# Altium project Motion Detector PCB.PrjPcb (part 1 of 4)
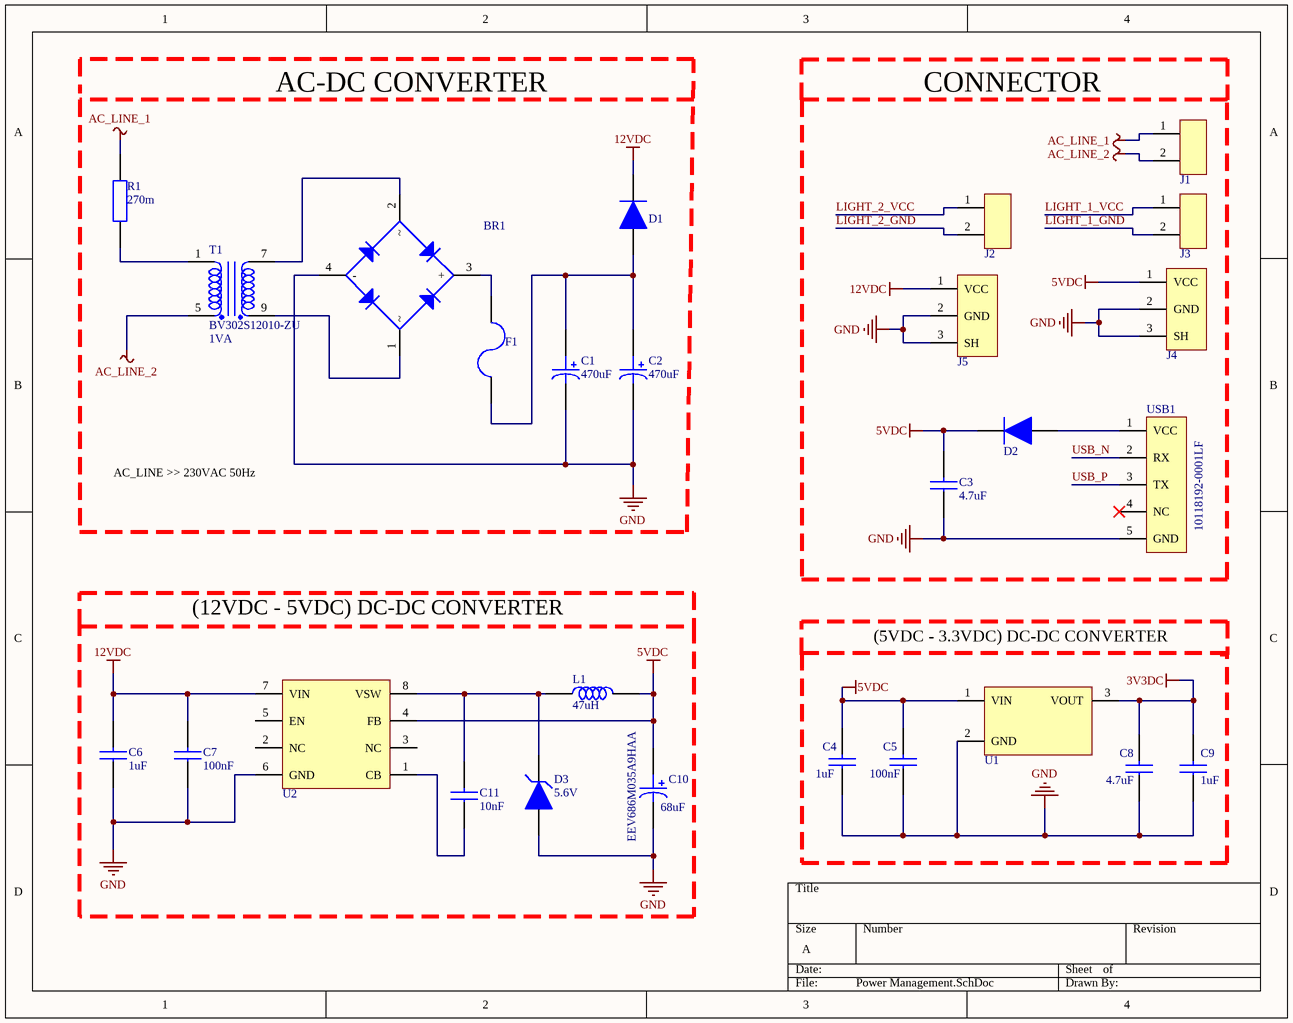
[diagram p0: Power Management.SchDoc]
5 sheets, 127 parts. Net scope: global (net labels, ports and power ports of the same name join across sheets).
Board file: Motion Detector PCB.PcbDoc
Sheets:
  Power Management.SchDoc
  MicroControllers.SchDoc
  Sensor Modules.SchDoc
  WIFI Module.SchDoc
  Sensor Board.SchDoc

## Sheet Power Management.SchDoc
size A; SheetNumber: 3; SheetTotal: 7

### Parts
BR1  DB105STR  [DB105STR]  (value not drawn)
C1  Capacitance: 470uF  [CAP_RADIAL_D10_P5]  (hidden comment: ESH477M050AH4AA)
C2  Capacitance: 470uF  [CAP_RADIAL_D10_P5]  (hidden comment: ESH477M050AH4AA)
C3  Capacitance: 4.7uF  [CAP_0805]  (hidden comment: CL21A475KAQNNNE)
C4  Capacitance: 1uF  [CAP_0805]  (hidden comment: CL21B105KBFNNNE)
C5  Capacitance: 100nF  [CAP_0805]  (hidden comment: CL21B104KBCNNNC)
C6  Capacitance: 1uF  [CAP_0805]  (hidden comment: CL21B105KBFNNNE)
C7  Capacitance: 100nF  [CAP_0805]  (hidden comment: CL21B104KBCNNNC)
C8  Capacitance: 4.7uF  [CAP_0805]  (hidden comment: CL21A475KAQNNNE)
C9  Capacitance: 1uF  [CAP_0805]  (hidden comment: CL21B105KBFNNNE)
C10  EEV686M035A9HAA  Capacitance: 68uF  [CAP_EEVseries]
C11  Capacitance: 10nF  [CAP_0603]  (hidden comment: 0603B103K160CT)
D1  1N4148WS  [SOD323F]  (value not drawn)
D2  1N4148WS  [SOD323F]  (value not drawn)
D3  Working Voltage: 5.6V  [SMB]  (hidden comment: 1SMB5919BT3G)
F1  3413.0216.22  [3413.0216.22]  (value not drawn)
J1  TBP01R1-508-02BE  [TBP01R1-508]  (value not drawn)
J2  TBP01R1-508-02BE  [TBP01R1-508]  (value not drawn)
J3  TBP01R1-508-02BE  [TBP01R1-508]  (value not drawn)
J4  PJ-037AH-SMT-TR  [JACK]  (value not drawn)
J5  PJ-037AH-SMT-TR  [JACK]  (value not drawn)
L1  Inductance: 47uH  [IND_1212]  (hidden comment: 78438335470)
R1  Resistance: 270m  [RES_AXIAL_W]  (hidden comment: 5WD27)
T1  BV302S12010-ZU  Rated Power: 1VA  [BV302S]
U1  AP7361-33E-13  [SOT223]  (value not drawn)
U2  LM2675MX-12/NOPB  [SOIC8]  (value not drawn)
USB1  10118192-0001LF  [MICRO_B_USB]

### Blocks framed on the sheet
CONNECTOR: C3 D2 J1-J5 USB1
(12VDC - 5VDC) DC-DC CONVERTER: C6 C7 C10 C11 D3 L1 U2
(5VDC - 3.3VDC) DC-DC CONVERTER: C4 C5 C8 C9 U1

### Nets
3V3DC: C8.2 C9.2 U1.3(VOUT)
5VDC: C3.2 C4.2 C5.2 C10.1 D2.1 J4.1(VCC) L1.2 U1.1(VIN) U2.4(FB)
12VDC: C6.2 C7.2 D1.1 J5.1(VCC) U2.7(VIN)
AC_LINE_1: J1.1 R1.1
AC_LINE_2: J1.2 T1.5
GND: BR1.4(-) C1.2 C2.2 C3.1 C4.1 C5.1 C6.1 C7.1 C8.1 C9.1 C10.2 D3.A J4.2(GND) J4.3(SH) J5.2(GND) J5.3(SH) U1.2(GND) U2.6(GND) USB1.5(GND)
LIGHT_1_GND: J3.2
LIGHT_1_VCC: J3.1
LIGHT_2_GND: J2.2
LIGHT_2_VCC: J2.1
USB_N: USB1.2(RX)
USB_P: USB1.3(TX)
NetBR1_1: BR1.1 T1.9
NetBR1_2: BR1.2 T1.7
NetBR1_3: BR1.3(+) F1.1
NetC1_1: C1.1 C2.1 D1.2 F1.2
NetC11_1: C11.1 U2.1(CB)
NetC11_2: C11.2 D3.C L1.1 U2.8(VSW)
NetD2_2: D2.2 USB1.1(VCC)
NetR1_2: R1.2 T1.1

Not connected (* = marked no-connect by the designer): U2 2(NC) 3(NC) 5(EN); USB1 4(NC)*

### Notes on the sheet
- AC-DC CONVERTER
- AC_LINE >> 230VAC 50Hz

### Library data of the parts
BR1 = DB105STR: Bridge Diode AC-DC; Manufacturer: Sangdest Microelectronics; Designed by: BERK; Max Current: 1A; Operating Voltage: 600V; Supplier 1: Digi-Key; Manufacturer Part Number: DB105STR; RoHS: No; Supplier Part Number 1: 1655-1821-1-ND
C1 C2 = CAP ALU ELEC 470uF 50V: CAP ALU ELEC 470uF 50V RADIAL; Manufacturer: KEMET; Designed by: BERK; Polarity: Polar; Tolerance: 20%; Life (Hours): 2000Hour; Supplier 1: Digi-Key; Manufacturer Part Number: ESH477M050AH4AA; RoHS: No; Stock 1: 1181; Pricing 1: 1=0,59000, 10=0,41700, 50=0,31540, 100=0,27470, 500=0,20350, 1000=0,17298, 2500=0,16280, 5000=0,15262 (USD); Mount: Through Hole; Case/Package: Radial; Min Operating Temperature: -40°C; Max Operating Temperature: 105°C; Packaging: Bulk; Voltage Rating: 50V; RoHS Compliant: No; ComponentLink1URL: https://api.kemet.com/component-edge/download/datasheet/ESH477M050AH4AA.pdf?src-supplier=Digi-Key; ComponentLink1Description: https://api.kemet.com/component-edge/download/datasheet/ESH477M050AH4AA.pdf?src-supplier=Digi-Key; Supplier Part Number 1: 399-15683-ND
C3 C8 = CAP CER 4.7uF 0805: CAP CER 4.7uF %10 0805; Manufacturer: Samsung; Tolerance: 10%; Voltage Rating: 25V; Dielectric: X5R; Designed by: BERK; Supplier 1: Digi-Key; Manufacturer Part Number: CL21A475KAQNNNE; RoHS: Yes; Category: Ceramic Capacitors; Stock 1: 1477018; Pricing 1: 1=0,11000, 10=0,08100, 50=0,04580, 100=0,03800, 500=0,02664, 1000=0,02205 (USD); Mount: Surface Mount; Case/Package: 0805; Case Code (Metric): 2012; Case Code (Imperial): 0805; Min Operating Temperature: -55°C; Max Operating Temperature: 85°C; Package Quantity: 1; Packaging: Tape and Reel; Voltage Rating (DC): 25V; Series: CL; Construction: Flat; Length: 2mm; Width: 0.049inch; Height: 1.25mm; Thickness: 0.055inch; Depth: 1.25mm; Radiation Hardening: No; Lead Free: Lead Free; RoHS Compliant: Yes; ComponentLink1URL: https://datasheet.ciiva.com/25798/cl21a475kaqnnne-25798882.pdf?src-supplier=Digi-Key; ComponentLink1Description: https://datasheet.ciiva.com/25798/cl21a475kaqnnne-25798882.pdf?src-supplier=Digi-Key; Supplier Part Number 1: 1276-1244-1-ND
C4 C6 C9 = CAP CER 1uF 0805: CAP CER 1uF %10 0805; Manufacturer: Samsung; Designed by: BERK; Tolerance: 10%; Voltage Rating: 50V; Dielectric: X7R; Supplier 1: Digi-Key; Manufacturer Part Number: CL21B105KBFNNNE; RoHS: Yes; Category: Ceramic Capacitors; Stock 1: 958000; Pricing 1: 2000=0,02138, 4000=0,01956 (USD); Mount: Surface Mount; Case/Package: 0805; Case Code (Metric): 2012; Case Code (Imperial): 0805; Min Operating Temperature: -55°C; Max Operating Temperature: 125°C; Packaging: Tape and Reel; Package Quantity: 1; Voltage: 50V; Series: CL; Construction: Flat; Length: 2mm; Width: 0.049inch; Height: 1.25mm; Thickness: 0.053inch; Depth: 1.25mm; Radiation Hardening: No; RoHS Compliant: Yes; ComponentLink1URL: https://datasheet.ciiva.com/25800/cl21b105kbfnnne-25800291.pdf?src-supplier=Digi-Key; ComponentLink1Description: https://datasheet.ciiva.com/25800/cl21b105kbfnnne-25800291.pdf?src-supplier=Digi-Key; ComponentLink2URL: https://datasheet.ciiva.com/16449/cl21b105kbfnnne-16449003.pdf?src-supplier=Future+Electronics; ComponentLink2Description: https://datasheet.ciiva.com/16449/cl21b105kbfnnne-16449003.pdf?src-supplier=Future+Electronics; ComponentLink3URL: https://datasheet.ciiva.com/26838/getdatasheetpartid-354075-26838668.pdf?src-supplier=Verical; ComponentLink3Description: https://datasheet.ciiva.com/26838/getdatasheetpartid-354075-26838668.pdf?src-supplier=Verical; Supplier Part Number 1: 1276-1029-2-ND
C5 C7 = CAP CER 100nF 0805: CAP CER 100nF %10 0805; Manufacturer: Samsung; Designed by: BERK; Material: Ceramic; Tolerance: 10%; Dielectric: X7R; Voltage Rating: 50V; Supplier 1: Digi-Key; Manufacturer Part Number: CL21B104KBCNNNC; RoHS: Yes; Category: Ceramic Capacitors; Stock 1: 3371502; Pricing 1: 1=0,10000, 10=0,04700, 50=0,02560, 100=0,02090, 500=0,01494, 1000=0,01174 (USD); Mount: Surface Mount; Case/Package: 0805; Case Code (Metric): 2012; Case Code (Imperial): 0805; Contact Plating: Tin; Min Operating Temperature: -55°C; Max Operating Temperature: 125°C; Packaging: Tape and Reel; Voltage: 50V; Voltage Rating (DC): 50V; Series: CL; Construction: Flat; Length: 2mm; Width: 0.049inch; Height: 0.85mm; Depth: 1.25mm; Thickness: 0.037inch; Radiation Hardening: No; Lead Free: Lead Free; RoHS Compliant: Yes; ComponentLink1URL: https://datasheet.ciiva.com/25710/cl21b104kbcnnnc-25710182.pdf?src-supplier=Digi-Key; ComponentLink1Description: https://datasheet.ciiva.com/25710/cl21b104kbcnnnc-25710182.pdf?src-supplier=Digi-Key; ComponentLink2URL: https://datasheet.ciiva.com/29199/454152-da-01-en-vs-kondensator-0805-29199814.pdf?src-supplier=Conrad; ComponentLink2Description: https://datasheet.ciiva.com/29199/454152-da-01-en-vs-kondensator-0805-29199814.pdf?src-supplier=Conrad; Supplier Part Number 1: 1276-1003-1-ND
C10 = CAP ALU 68uF: Cap Aluminum Lytic 68uF 35V 20% (6.3 X 7.7mm) SMD 280mA 2000h 105C T/R; Manufacturer: KEMET; Impedance: 340mR; Ripple Current: 196mA; Life (Hours): 2000Hour; Designator by: BERK; Supplier 1: Digi-Key; Manufacturer Part Number: EEV686M035A9HAA; RoHS: Yes; Category: Aluminum Electrolytic Capacitors; Stock 1: 543; Pricing 1: 1=0,54000, 10=0,38000, 50=0,28740, 100=0,25040, 500=0,18546 (USD); Mount: Surface Mount; Case/Package: Radial; Min Operating Temperature: -40°C; Max Operating Temperature: 105°C; Packaging: Tape and Reel; Package Quantity: 1; Voltage Rating: 35V; Tolerance: 20%; Voltage Rating (DC): 35V; Termination: SMD/SMT; Series: EEV; Length: 7.7mm; Height - Seated (Max): 0.315inch; RoHS Compliant: Yes; ComponentLink1URL: https://datasheet.ciiva.com/5365/kem-a4002-eev-535332-5365784.pdf?src-supplier=Mouser; ComponentLink1Description: https://datasheet.ciiva.com/5365/kem-a4002-eev-535332-5365784.pdf?src-supplier=Mouser; Supplier Part Number 1: 399-6722-1-ND
C11 = CAP CER 10nF 0603: CAP CER 10nF %10 0603; Manufacturer: Walsin Technologies; Designed by: BERK; Tolerance: 10%; Dielectric: X7R; Voltage Rating: 16V; Supplier 1: Digi-Key; Manufacturer Part Number: 0603B103K160CT; RoHS: Yes; Category: Ceramic Capacitors; Stock 1: 102474; Pricing 1: 1=0,10000, 10=0,03600, 50=0,01940, 100=0,01590, 500=0,01136, 1000=0,00892 (USD); Case/Package: 0603; Case Code (Metric): 1608; Case Code (Imperial): 0603; Min Operating Temperature: -55°C; Max Operating Temperature: 125°C; Packaging: Tape and Reel; Voltage Rating (DC): 16V; Length: 1.6mm; Depth: 0.8mm; REACH SVHC: Unknown; RoHS Compliant: Yes; ComponentLink1URL: http://www.farnell.com/datasheets/1958513.pdf?src-supplier=Farnell; ComponentLink1Description: http://www.farnell.com/datasheets/1958513.pdf?src-supplier=Farnell; ComponentLink2URL: http://components.arrow.com/part/dataview/0323_00656382?src-supplier=Arrow+Europe; ComponentLink2Description: http://components.arrow.com/part/dataview/0323_00656382?src-supplier=Arrow+Europe; ComponentLink3URL: http://www.farnell.com/datasheets/1958513.pdf?src-supplier=Element14; ComponentLink3Description: http://www.farnell.com/datasheets/1958513.pdf?src-supplier=Element14; ComponentLink4URL: http://www.passivecomponent.com/wp-content/uploads/2018/10/MLCC.pdf?src-supplier=Digi-Key; ComponentLink4Description: http://www.passivecomponent.com/wp-content/uploads/2018/10/MLCC.pdf?src-supplier=Digi-Key; Supplier Part Number 1: 1292-1384-1-ND
D1 D2 = 1N4148WS: Diode, Single, 75 V, 150 mA, 1 V, 4 ns; Manufacturer: ON Semiconductor / Fairchild; Designed by: BERK; Forward Current: 150mA; Reverse Recovery Time: 4ns; Max Repetitive Reverse Voltage (Vrrm): 75V; Power Dissipation: 200mW; Max Reverse Current: 5uA; Forward Voltage: 1V; Max Forward Surge Current (Ifsm): 2A; Supplier 1: Digi-Key; Manufacturer Part Number: 1N4148WS; RoHS: Yes; Category: Rectifier Diodes; Stock 1: 79118; Pricing 1: 1=0,17000, 10=0,12100, 100=0,06530, 500=0,05128, 1000=0,03562 (USD); Mount: Surface Mount; Number of Pins: 2; Contact Plating: Tin,Matte; Weight: 0.0276g; Min Operating Temperature: -55°C; Max Operating Temperature: 150°C; Packaging: Tape and Reel; Package Quantity: 1; Recovery Time: 4ns; Average Rectified Current: 150mA; Element Configuration: Single; Reverse Voltage: 75V; Max Reverse Voltage (DC): 75V; Series: -; Length: 1.8mm; Width: 1.35mm; Height: 1mm; Radiation Hardening: No; REACH SVHC: No SVHC; Lead Free: Lead Free; RoHS Compliant: Yes; ComponentLink1URL: https://datasheet.ciiva.com/25968/1n914bws-25968945.pdf?src-supplier=Avnet+Europe; ComponentLink1Description: https://datasheet.ciiva.com/25968/1n914bws-25968945.pdf?src-supplier=Avnet+Europe; ComponentLink2URL: https://datasheet.ciiva.com/30479/0900766b810e1cd3-30479206.pdf?src-supplier=RSComponents; ComponentLink2Description: https://datasheet.ciiva.com/30479/0900766b810e1cd3-30479206.pdf?src-supplier=RSComponents; ComponentLink3URL: https://datasheet.ciiva.com/910/1n4148ws-910381.pdf?src-supplier=Digi-Key; ComponentLink3Description: https://datasheet.ciiva.com/910/1n4148ws-910381.pdf?src-supplier=Digi-Key; ComponentLink4URL: https://datasheet.ciiva.com/15208/getdatasheetpartid-127819-15208358.pdf?src-supplier=Verical; ComponentLink4Description: https://datasheet.ciiva.com/15208/getdatasheetpartid-127819-15208358.pdf?src-supplier=Verical; ComponentLink5URL: https://datasheet.ciiva.com/8300/1n914bws-8300360.pdf?src-supplier=Avnet; ComponentLink5Description: https://datasheet.ciiva.com/8300/1n914bws-8300360.pdf?src-supplier=Avnet; ComponentLink6URL: https://datasheet.ciiva.com/910/1n4148ws-910380.pdf?src-supplier=Digi-Key; ComponentLink6Description: https://datasheet.ciiva.com/910/1n4148ws-910380.pdf?src-supplier=Digi-Key; ComponentLink7URL: https://datasheet.ciiva.com/910/1n4148ws-910382.pdf?src-supplier=Digi-Key; ComponentLink7Description: https://datasheet.ciiva.com/910/1n4148ws-910382.pdf?src-supplier=Digi-Key; Supplier Part Number 1: 1N4148WSFSCT-ND
D3 = 1SMB5919BT3G: Diode Zener Single 5.6V 5% 3W 2-Pin SMB T/R; Manufacturer: ON Semiconductor; Designed by: BERK; Material: Plastic; Max Reverse Leakage Current: 5uA; Impedance: 2R; Forward Voltage: 1.5V; Power Dissipation: 550mW; Zener Current: 267mA; Test Current: 66.9mA; Breakdown Voltage: 5.88V; ESD Protection: Yes; Supplier 1: Digi-Key; Manufacturer Part Number: 1SMB5919BT3G; RoHS: Yes; Category: Zener Diodes; Pricing 1: 1=0,45000, 10=0,31900, 100=0,16110, 500=0,14274, 1000=0,11109 (USD); Case/Package: SMB; Number of Pins: 2; Contact Plating: Tin,Matte; Min Operating Temperature: -65°C; Max Operating Temperature: 150°C; Package Quantity: 1; Packaging: Tape and Reel; Max Power Dissipation: 3W; Tolerance: 5%; Voltage Tolerance: 5%; Zener Voltage: 5.6V; Element Configuration: Single; Voltage Rating (DC): 5.6V; Power Rating: 3W; Length: 4.32mm; Width: 3.56mm; Height: 2.13mm; Radiation Hardening: No; Lead Free: Lead Free; Halogen Free: Halogen Free; REACH SVHC: No SVHC; ComponentLink1URL: https://datasheet.ciiva.com/27747/1308331-27747654.pdf?src-supplier=Jameco; ComponentLink1Description: https://datasheet.ciiva.com/27747/1308331-27747654.pdf?src-supplier=Jameco; ComponentLink2URL: https://datasheet.ciiva.com/1182/1smb5913bt3-d-1182657.pdf?src-supplier=Element14; ComponentLink2Description: https://datasheet.ciiva.com/1182/1smb5913bt3-d-1182657.pdf?src-supplier=Element14; ComponentLink3URL: https://datasheet.ciiva.com/1182/1smb5913bt3-d-1182658.pdf?src-supplier=Element14; ComponentLink3Description: https://datasheet.ciiva.com/1182/1smb5913bt3-d-1182658.pdf?src-supplier=Element14; ComponentLink4URL: https://datasheet.ciiva.com/895/1smb5913bt3-d-895203.pdf?src-supplier=Digi-Key; ComponentLink4Description: https://datasheet.ciiva.com/895/1smb5913bt3-d-895203.pdf?src-supplier=Digi-Key; ComponentLink5URL: https://datasheet.ciiva.com/895/1smb5913bt3-d-895204.pdf?src-supplier=Digi-Key; ComponentLink5Description: https://datasheet.ciiva.com/895/1smb5913bt3-d-895204.pdf?src-supplier=Digi-Key; ComponentLink6URL: https://datasheet.ciiva.com/895/1smb5913bt3-d-895205.pdf?src-supplier=Digi-Key; ComponentLink6Description: https://datasheet.ciiva.com/895/1smb5913bt3-d-895205.pdf?src-supplier=Digi-Key; ComponentLink7URL: https://datasheet.ciiva.com/15198/getdatasheetpartid-311040-15198695.pdf?src-supplier=Verical; ComponentLink7Description: https://datasheet.ciiva.com/15198/getdatasheetpartid-311040-15198695.pdf?src-supplier=Verical; ComponentLink8URL: https://datasheet.ciiva.com/16311/1smb5913bt3-d-16311847.pdf?src-supplier=Future+Electronics; ComponentLink8Description: https://datasheet.ciiva.com/16311/1smb5913bt3-d-16311847.pdf?src-supplier=Future+Electronics; ComponentLink9URL: https://datasheet.ciiva.com/16472/1smb5913bt3-d-16472779.pdf?src-supplier=Avnet+Asia; ComponentLink9Description: https://datasheet.ciiva.com/16472/1smb5913bt3-d-16472779.pdf?src-supplier=Avnet+Asia; Max Reverse Current: 5uA; Supplier Part Number 1: 1SMB5919BT3GOSCT-ND
F1 = FUSE 3413.0216.22: FUSE BRD MNT 1A 32VAC 63VDC 1206; Manufacturer: Schurter; Body Material: Glass,Epoxy; Max Voltage Rating (DC): 63V; Voltage Rating (AC): 32V; DC Cold Resistance: 94.2mR; Fuse Type: Board Mount (Cartridge Style Excluded); Approvals: VDE,cURus; Designed by: BERK; Supplier 1: Digi-Key; Manufacturer Part Number: 3413.0216.22; RoHS: Yes; Category: Fuses; Stock 1: 609; Pricing 1: 1=0,67000, 50=0,52400, 100=0,39700, 500=0,31100 (USD); Mount: Surface Mount,PCB; Case/Package: 1206; Number of Pins: 2; Weight: 0.000212oz; Case Code (Metric): 3216; Case Code (Imperial): 1206; Contact Plating: Gold; Housing Material: Glass; Terminal Material: Tin; Min Operating Temperature: -55°C; Max Operating Temperature: 90°C; Current Rating: 1A; Package Quantity: 1000; Voltage Rating (DC): 63V; Packaging: Tape and Reel; Max Voltage Rating (AC): 32V; Voltage Rating: 32V; Termination: SMD/SMT; Working Voltage: 32V; Series: USI 1206; Length: 3.2mm; Width: 1.6mm; Height: 0.6mm; Depth: 1.6mm; Radiation Hardening: No; Lead Free: Lead Free; RoHS Compliant: Yes; ComponentLink1URL: https://datasheet.ciiva.com/301/typ-usi-1206-301440.pdf?src-supplier=Digi-Key; ComponentLink1Description: https://datasheet.ciiva.com/301/typ-usi-1206-301440.pdf?src-supplier=Digi-Key; ComponentLink2URL: https://datasheet.ciiva.com/14541/70160006-14541114.pdf?src-supplier=Allied+Electronics; ComponentLink2Description: https://datasheet.ciiva.com/14541/70160006-14541114.pdf?src-supplier=Allied+Electronics; ComponentLink3URL: https://datasheet.ciiva.com/301/typ-usi-1206-301439.pdf?src-supplier=Digi-Key; ComponentLink3Description: https://datasheet.ciiva.com/301/typ-usi-1206-301439.pdf?src-supplier=Digi-Key; ComponentLink4URL: https://datasheet.ciiva.com/301/typ-usi-1206-301441.pdf?src-supplier=Digi-Key; ComponentLink4Description: https://datasheet.ciiva.com/301/typ-usi-1206-301441.pdf?src-supplier=Digi-Key; ComponentLink5URL: https://datasheet.ciiva.com/8264/typ-usi-1206-8264583.pdf?src-supplier=Avnet; ComponentLink5Description: https://datasheet.ciiva.com/8264/typ-usi-1206-8264583.pdf?src-supplier=Avnet; ComponentLink6URL: https://datasheet.ciiva.com/14102/qousi1206-data-e-14102903.pdf?src-supplier=Distrelec; ComponentLink6Description: https://datasheet.ciiva.com/14102/qousi1206-data-e-14102903.pdf?src-supplier=Distrelec; ComponentLink7URL: https://datasheet.ciiva.com/17405/typ-usi-1206-17405433.pdf?src-supplier=Avnet+Europe; ComponentLink7Description: https://datasheet.ciiva.com/17405/typ-usi-1206-17405433.pdf?src-supplier=Avnet+Europe; ComponentLink8URL: https://datasheet.ciiva.com/16316/typ-usi-1206-16316588.pdf?src-supplier=Future+Electronics; ComponentLink8Description: https://datasheet.ciiva.com/16316/typ-usi-1206-16316588.pdf?src-supplier=Future+Electronics; Supplier Part Number 1: 486-1144-1-ND
J1-J3 = TBP01R1-508-02BE: Conn Shrouded Header HDR 2 POS 5.08mm Solder RA Side Entry Thru-Hole Bag; Manufacturer: CUI; Designed by: BERK; Supplier 1: Digi-Key; Manufacturer Part Number: TBP01R1-508-02BE; RoHS: No; Stock 1: 3398; Pricing 1: 1=0,50000, 10=0,26500, 25=0,18760, 50=0,15960, 100=0,15400, 250=0,13020, 500=0,12040, 1000=0,10640, 5000=0,08120 (USD); Supplier Part Number 1: 102-6406-ND
J4 J5 = PJ-037AH-SMT-TR: DC Power Connectors Power Jacks; Manufacturer: CUI; Designed by: BERK; Number of Conductors: 2; Gender: Male; Shielding: Unshielded; Current Rating: 5A; Voltage Rating: 24V; Insulation Resistance: 100MR; Supplier 1: Digi-Key; Manufacturer Part Number: PJ-037AH-SMT-TR; RoHS: Yes; Category: Connectors; Stock 1: 4972; Pricing 1: 1=1,36000, 10=1,19300, 25=1,12320, 50=1,07640, 100=1,02960 (USD); Mount: Surface Mount,Through Hole; Case/Package: SMD/SMT; Color: Black; Contact Material: Copper; Contact Plating: Nickel; Housing Color: Black; Housing Material: Thermoplastic; Min Operating Temperature: -25°C; Max Operating Temperature: 85°C; Orientation: Horizontal; Package Quantity: 200; Termination: Solder; Connector Type: Jack; Contact Gender: Male; Packaging: Tape and Reel; Flammability Rating: UL94 V-0; ComponentLink1URL: http://www.mouser.com/ds/2/670/pj-037ah-smt-516065.pdf?src-supplier=Mouser; ComponentLink1Description: http://www.mouser.com/ds/2/670/pj-037ah-smt-516065.pdf?src-supplier=Mouser; ComponentLink2URL: https://www.cui.com/product/resource/digikeypdf/pj-037ah-smt-tr.pdf?src-supplier=Digi-Key; ComponentLink2Description: https://www.cui.com/product/resource/digikeypdf/pj-037ah-smt-tr.pdf?src-supplier=Digi-Key; ComponentLink3URL: http://www.cui.com/product/resource/digikeypdf/pj-037ah-smt.pdf?src-supplier=Digi-Key; ComponentLink3Description: http://www.cui.com/product/resource/digikeypdf/pj-037ah-smt.pdf?src-supplier=Digi-Key; Supplier Part Number 1: CP-037AHPJCT-ND
L1 = IND 47uH: FIXED IND 47UH 390MA 2.3 OHM SMD; Manufacturer: Wurth Electronics; Core Material: Ferrite; Saturation Current: 1.18A; Shielding: Shielded; DC Resistance (DCR): 2.3R; Self Resonant Frequency: 8MHz; Test Frequency: 100kHz; Tolerance: 30%; Designed by: BERK; Supplier 1: Digi-Key; Manufacturer Part Number: 78438335470; RoHS: No; Category: Fixed Inductors; Stock 1: 885; Pricing 1: 1=1,98000, 50=1,84800, 250=1,69100, 500=1,56800 (USD); Mount: Surface Mount; Case/Package: 1212; Case Code (Metric): 3030; Case Code (Imperial): 1212; Min Operating Temperature: -40°C; Max Operating Temperature: 125°C; Packaging: Tape and Reel; Resistor Type: Wirewound; Current Rating: 390mA; Length: 0.118inch; Width: 0.118inch; Height - Seated (Max): 0.059inch; Ratings: AEC-Q200; RoHS Compliant: No; ComponentLink1URL: https://media.digikey.com/pdf/Data%20Sheets/Wurth%20Electronics%20PDFs/Q+_Products_Flyer.pdf?src-supplier=Digi-Key; ComponentLink1Description: https://media.digikey.com/pdf/Data%20Sheets/Wurth%20Electronics%20PDFs/Q+_Products_Flyer.pdf?src-supplier=Digi-Key; Supplier Part Number 1: 732-6947-1-ND
R1 = 5WD27: Resistor 5 Watt Cermet Wirewound Flameproof .27 Ohm 5% Axial Lead; Manufacturer: NTE Electronics; Designed by: BERK; Power Rating: 5W; Temperature Coefficient: 300ppm/°C; Supplier 1: Newark; Manufacturer Part Number: 5WD27; Category: Through-Hole Resistors; Pricing 1: 1=0,47600 (USD); Mount: Through Hole; Case/Package: Axial; Min Operating Temperature: -55°C; Max Operating Temperature: 155°C; Tolerance: 5%; Termination: Axial; RoHS Compliant: No; ComponentLink1URL: https://datasheet.ciiva.com/15772/fivewire-15772442.pdf?src-supplier=Onlinecomponents.com; ComponentLink1Description: https://datasheet.ciiva.com/15772/fivewire-15772442.pdf?src-supplier=Onlinecomponents.com; ComponentLink2URL: http://datasheet.octopart.com/5WD27-NTE-Electronics-datasheet-137435208.pdf?src-supplier=NTE+Electronics; ComponentLink2Description: http://datasheet.octopart.com/5WD27-NTE-Electronics-datasheet-137435208.pdf?src-supplier=NTE+Electronics; ComponentLink3URL: http://datasheet.octopart.com/5WD27-NTE-Electronics-datasheet-21210163.pdf?src-supplier=Master+Electronics; ComponentLink3Description: http://datasheet.octopart.com/5WD27-NTE-Electronics-datasheet-21210163.pdf?src-supplier=Master+Electronics; Supplier Part Number 1: 33C8814
T1 = BV302S12010-ZU: 230-12 Transformer 1VA; Manufacturer: Zettler Magnetics; Designed by: BERK; Primary Voltage: 230V; Secondary Voltage: 12V; Operating Frequency: 50-60Hz; Supplier 1: Digi-Key; Manufacturer Part Number: BV302S12010-ZU; RoHS: No; Supplier Part Number 1: 2469-BV302S12010-ZU-ND
U1 = AP7361-33E-13: LDO Regulator Pos 3.3V 1A 4-Pin(3+Tab) SOT-223 T/R; Manufacturer: Diodes; Designed by: BERK; Number of Outputs: 1; Min Input Voltage: 2.2V; Max Input Voltage: 6V; Max Power Dissipation: 1.1W; Dropout Voltage: 500mV; Min Current Limit: 1.1A; Polarity: Positive; Quiescent Current: 70uA; Power Dissipation: 1.1kW; Accuracy: 1%; Power Supply Rejection Ratio (PSRR): 65dB; Reference Voltage: 800mV; Output Type: Fixed; Supplier 1: Digi-Key; Manufacturer Part Number: AP7361-33E-13; RoHS: Yes; Category: Voltage Regulators - Linear; Stock 1: 45122; Pricing 1: 1=0,51000, 10=0,41400, 25=0,37840, 100=0,25510, 250=0,21116, 500=0,19356, 1000=0,14517 (USD); Mount: Surface Mount; Case/Package: SOT-223; Number of Pins: 4; Weight: 0.000282oz; Contact Plating: Tin,Matte; Min Operating Temperature: -40°C; Max Operating Temperature: 85°C; Max Output Current: 1A; Output Voltage: 3.3V; Package Quantity: 1; Packaging: Tape and Reel; Output Current: 1A; Number of Regulators: 1; Series: -; Radiation Hardening: No; REACH SVHC: No SVHC; Lead Free: Lead Free; RoHS Compliant: Yes; ComponentLink1URL: https://datasheet.ciiva.com/26926/getdatasheetpartid-670786-26926141.pdf?src-supplier=Verical; ComponentLink1Description: https://datasheet.ciiva.com/26926/getdatasheetpartid-670786-26926141.pdf?src-supplier=Verical; ComponentLink2URL: https://datasheet.ciiva.com/25651/ap7361-25651049.pdf?src-supplier=Digi-Key; ComponentLink2Description: https://datasheet.ciiva.com/25651/ap7361-25651049.pdf?src-supplier=Digi-Key; ComponentLink3URL: https://datasheet.ciiva.com/29568/ap7361-29568378.pdf?src-supplier=Digi-Key; ComponentLink3Description: https://datasheet.ciiva.com/29568/ap7361-29568378.pdf?src-supplier=Digi-Key; ComponentLink4URL: https://datasheet.ciiva.com/29568/ap7361-29568379.pdf?src-supplier=Digi-Key; ComponentLink4Description: https://datasheet.ciiva.com/29568/ap7361-29568379.pdf?src-supplier=Digi-Key; Supplier Part Number 1: AP7361-33E-13DICT-ND
U2 = LM2675MX-12/NOPB: Switching Voltage Regulators Pwr Cnvtr Hi Eff 1A SD Vtg Reg; Manufacturer: TI National Semiconductor; Designed by: BERK; Number of Outputs: 1; Output Voltage: 12V; Min Input Voltage: 8V; Max Input Voltage: 40V; Efficiency: 94%; Switching Frequency: 260kHz; Synchronous Rectifier: No; Quiescent Current: 2.5mA; Output Type: Fixed; Supplier 1: Digi-Key; Manufacturer Part Number: LM2675MX-12/NOPB; RoHS: Yes; Category: Voltage Regulators - Switching; Stock 1: 1475; Pricing 1: 1=4,49000, 10=4,03600, 25=3,81600, 100=3,13760, 250=2,81536, 500=2,71360, 1000=2,25568 (USD); Mount: Surface Mount; Case/Package: SOIC N; Number of Pins: 8; Contact Plating: Tin; Min Operating Temperature: -40°C; Max Operating Temperature: 125°C; Max Output Current: 1A; Operating Supply Voltage: 40V; Output Current: 1A; Packaging: Tape and Reel; Package Quantity: 2500; Series: LM2675; Radiation Hardening: No; Lead Free: Lead Free; RoHS Compliant: Yes; ComponentLink1URL: https://datasheet.ciiva.com/41457/001013881-da-01-en-ic-reg-buck-lm2675mx-12-nopb-soic-8-tid-41457896.pdf?src-supplier=Conrad; ComponentLink1Description: https://datasheet.ciiva.com/41457/001013881-da-01-en-ic-reg-buck-lm2675mx-12-nopb-soic-8-tid-41457896.pdf?src-supplier=Conrad; ComponentLink2URL: https://datasheet.ciiva.com/3220/lm2675-3220840.pdf?src-supplier=Avnet; ComponentLink2Description: https://datasheet.ciiva.com/3220/lm2675-3220840.pdf?src-supplier=Avnet; Supplier Part Number 1: 296-35410-1-ND
USB1 = Micro B USB Connector: CONN RCPT USB2.0 MICRO B SMD R/A; Manufacturer: Amphenol FCI; Designed by: BERK; Number of Terminals/Pins: 5; Gender: Receptacle; Current Rating: 1.8A; Connector Type: USB,Receptacle; Number of Ports: 1; Insulation Resistance: 1GR; Max Voltage Rating (AC): 100V; Pitch: 0.65mm; Supplier 1: Digi-Key; Manufacturer Part Number: 10118192-0001LF; RoHS: Yes; Category: USB Connectors; Stock 1: 158200; Pricing 1: 1400=0,22558, 2800=0,20624, 7000=0,19335, 9800=0,18046, 14000=0,17402, 35000=0,17144 (USD); Mount: Surface Mount,Horizontal; Contact Plating: Gold; Contact Material: Copper Alloy; Color: Black; Housing Material: Polymer; Min Operating Temperature: -55°C; Max Operating Temperature: 85°C; Termination: Solder; Packaging: Tape and Reel; Number of Contacts: 5; Orientation: Right Angle; Package Quantity: 1400; Features: Shielded; Voltage Rating: 100V; USB Standard: USB 2.0; Length: 7.86mm; Depth: 5.57mm; Radiation Hardening: No; Flammability Rating: UL94 V-0; Lead Free: Lead Free; REACH SVHC: No SVHC; ComponentLink1URL: https://datasheet.ciiva.com/26853/getdatasheetpartid-418041-26853891.pdf?src-supplier=Verical; ComponentLink1Description: https://datasheet.ciiva.com/26853/getdatasheetpartid-418041-26853891.pdf?src-supplier=Verical; ComponentLink2URL: https://datasheet.ciiva.com/851/10118192-851112.pdf?src-supplier=Digi-Key; ComponentLink2Description: https://datasheet.ciiva.com/851/10118192-851112.pdf?src-supplier=Digi-Key; ComponentLink3URL: https://datasheet.ciiva.com/4598/10118192ac-197249-4598796.pdf?src-supplier=Mouser; ComponentLink3Description: https://datasheet.ciiva.com/4598/10118192ac-197249-4598796.pdf?src-supplier=Mouser; Supplier Part Number 1: 609-4613-2-ND